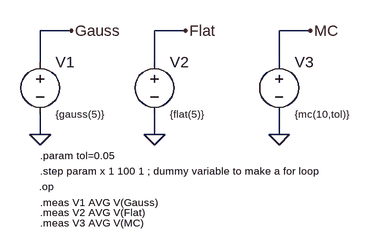
[diagram p0: schematic DC Operating Point Different Probability Distribution.asc]
DC Operating Point Different Probability Distribution.asc, the LTspice schematic file:
Version 4
SHEET 1 880 680
WIRE 32 64 -16 64
WIRE 208 64 160 64
WIRE 400 64 352 64
WIRE -16 112 -16 64
WIRE 160 112 160 64
WIRE 352 112 352 64
WIRE -16 224 -16 192
WIRE 160 224 160 192
WIRE 352 224 352 192
FLAG -16 224 0
FLAG 160 224 0
FLAG 352 224 0
FLAG 32 64 Gauss
FLAG 208 64 Flat
FLAG 400 64 MC
SYMBOL voltage -16 96 R0
WINDOW 3 24 96 Left 1
SYMATTR InstName V1
SYMATTR Value {gauss(5)}
SYMBOL voltage 160 96 R0
WINDOW 3 24 96 Left 1
SYMATTR InstName V2
SYMATTR Value {flat(5)}
SYMBOL voltage 352 96 R0
WINDOW 3 24 96 Left 1
SYMATTR InstName V3
SYMATTR Value {mc(10,tol)}
TEXT -16 256 Left 1 !.param tol=0.05
TEXT -16 280 Left 1 !.step param x 1 100 1 ; dummy variable to make a for loop
TEXT -18 304 Left 1 !.op
TEXT -16 328 Left 1 !.meas V1 AVG V(Gauss)
TEXT -16 344 Left 1 !.meas V2 AVG V(Flat)
TEXT -16 360 Left 1 !.meas V3 AVG V(MC)

The netlist it stands for:
* DC Operating Point Different Probability Distribution.asc
V1 Gauss 0 {gauss(5)}
V2 Flat 0 {flat(5)}
V3 MC 0 {mc(10,tol)}
.param tol=0.05
.step param x 1 100 1 ; dummy variable to make a for loop
.op
.meas V1 AVG V(Gauss)
.meas V2 AVG V(Flat)
.meas V3 AVG V(MC)
.backanno
.end